# EasyEDA Pro project UrmoukyOpenIPC_250722_v0.2（有小bug不影响使用）.epro, schematic OpenIPC_SSC338Q

## Sheets
1 SSC338Q: Board Name: OpenIPC_SSC338Q; Create Date: 2025-07-22; Page Name: SSC338Q; Project Name: UrmoukyOpenIPC; Schematic Name: OpenIPC_SSC338Q; Update Date: 2025-07-22; Company: 嘉立创EDA; Page Size: A3; Version: V1.0
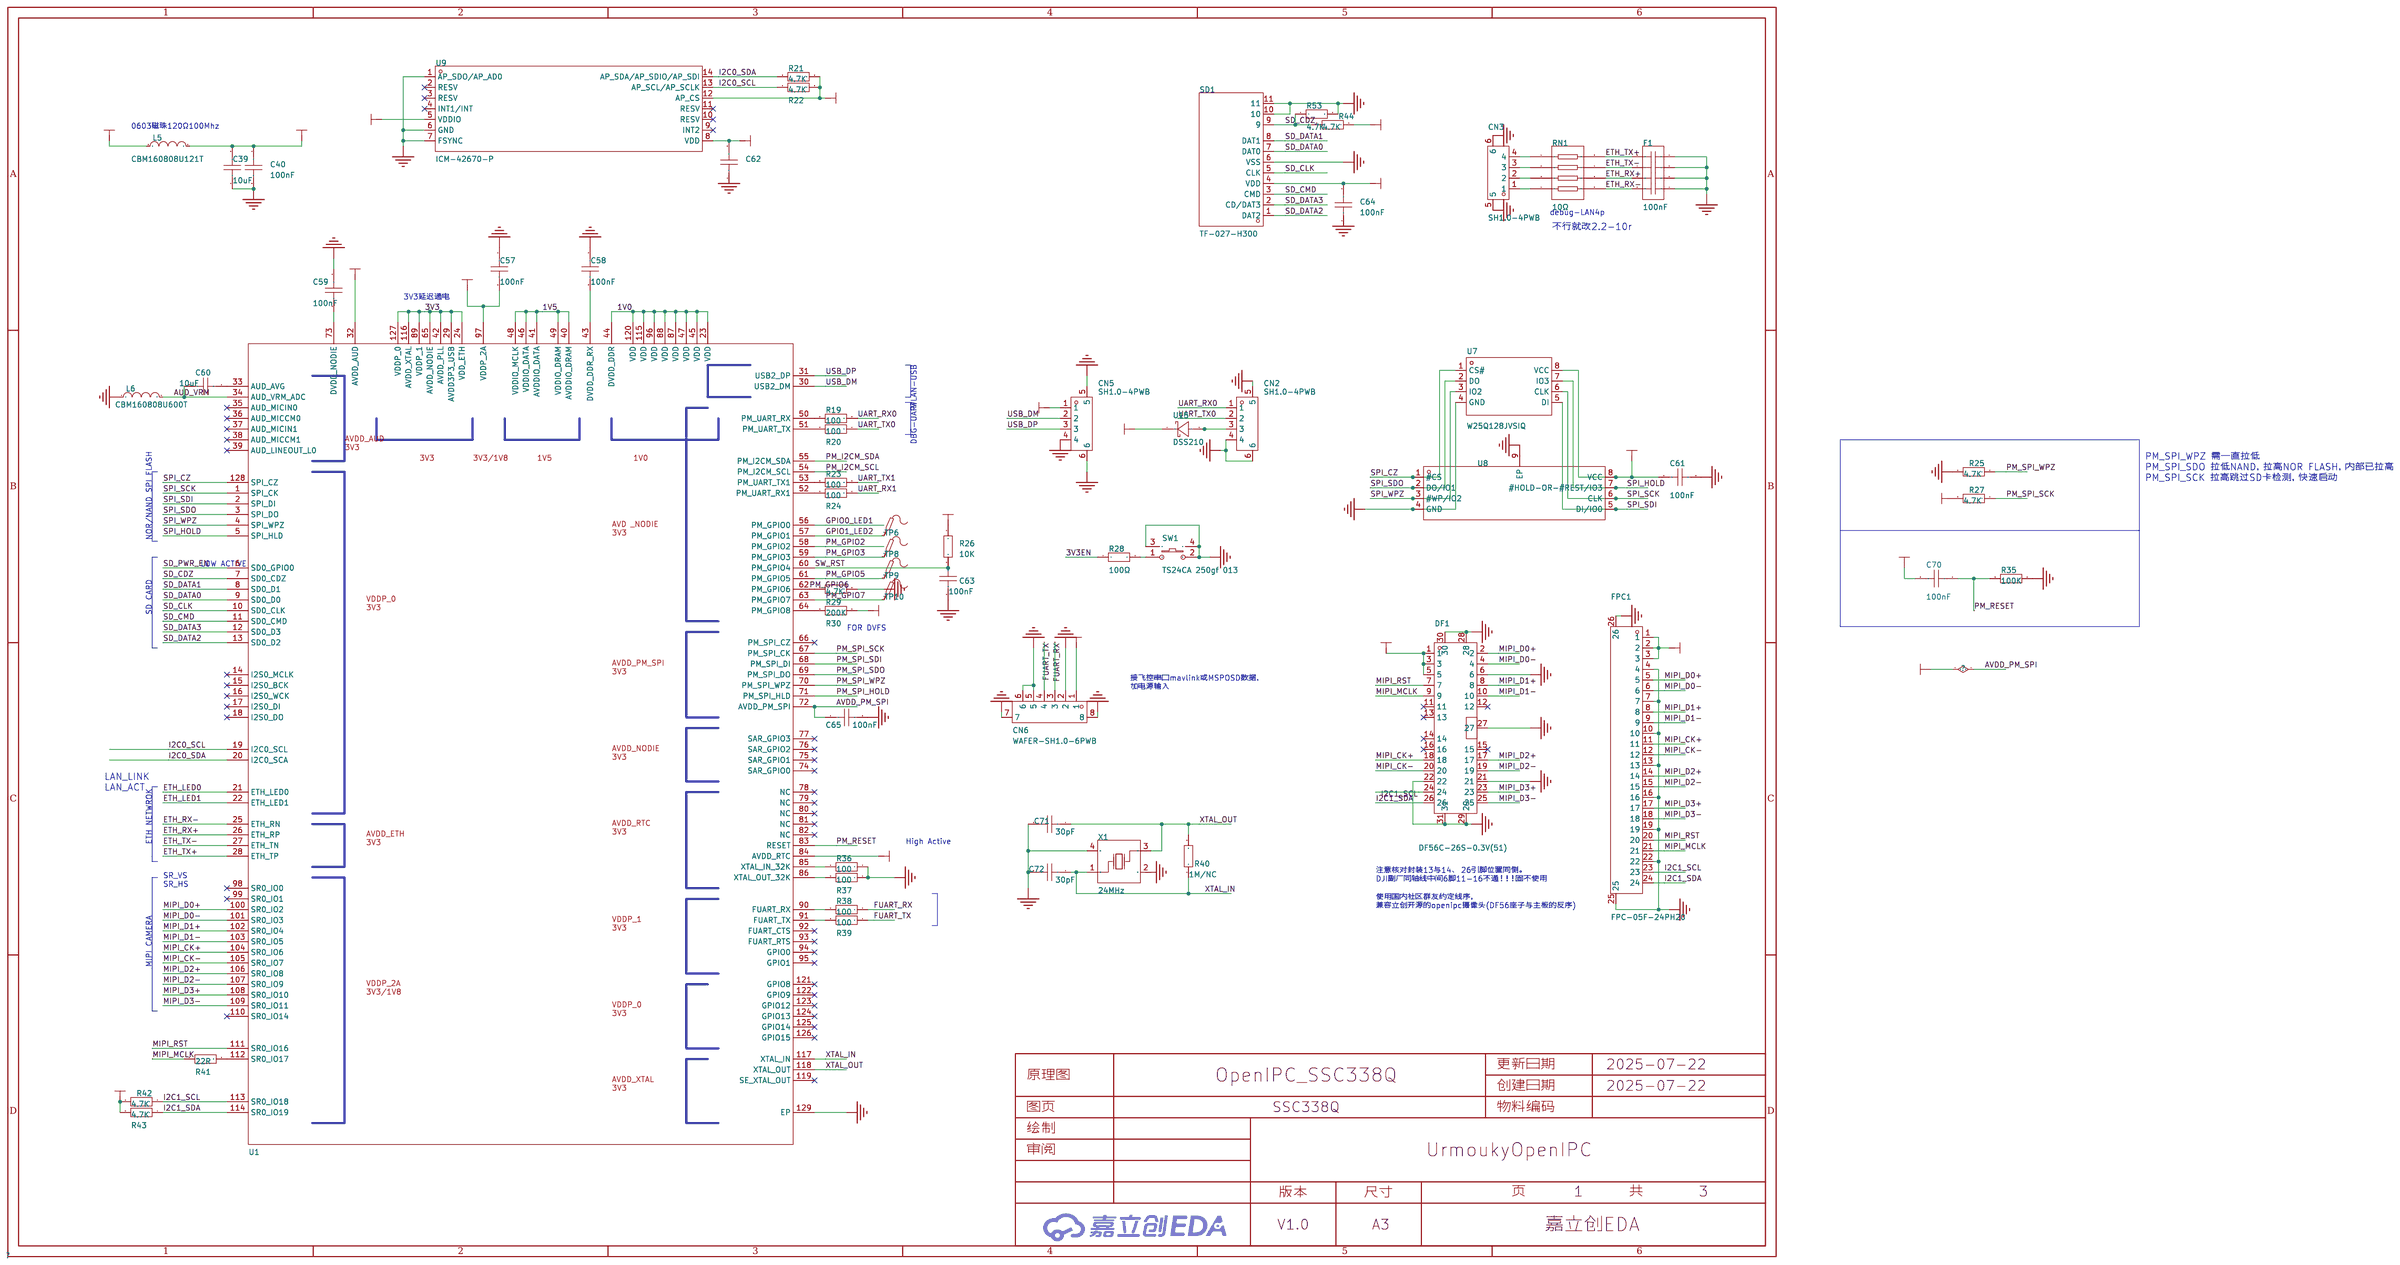
[diagram p0: SSC338Q]
2 Power: Board Name: 338Q改版成品; Create Date: 2025-07-07; Page Name: Power; Project Name: OpenIPC_Urmouky_rebuild; Schematic Name: Schematic1_2; Update Date: 2025-07-08; Page Size: A4
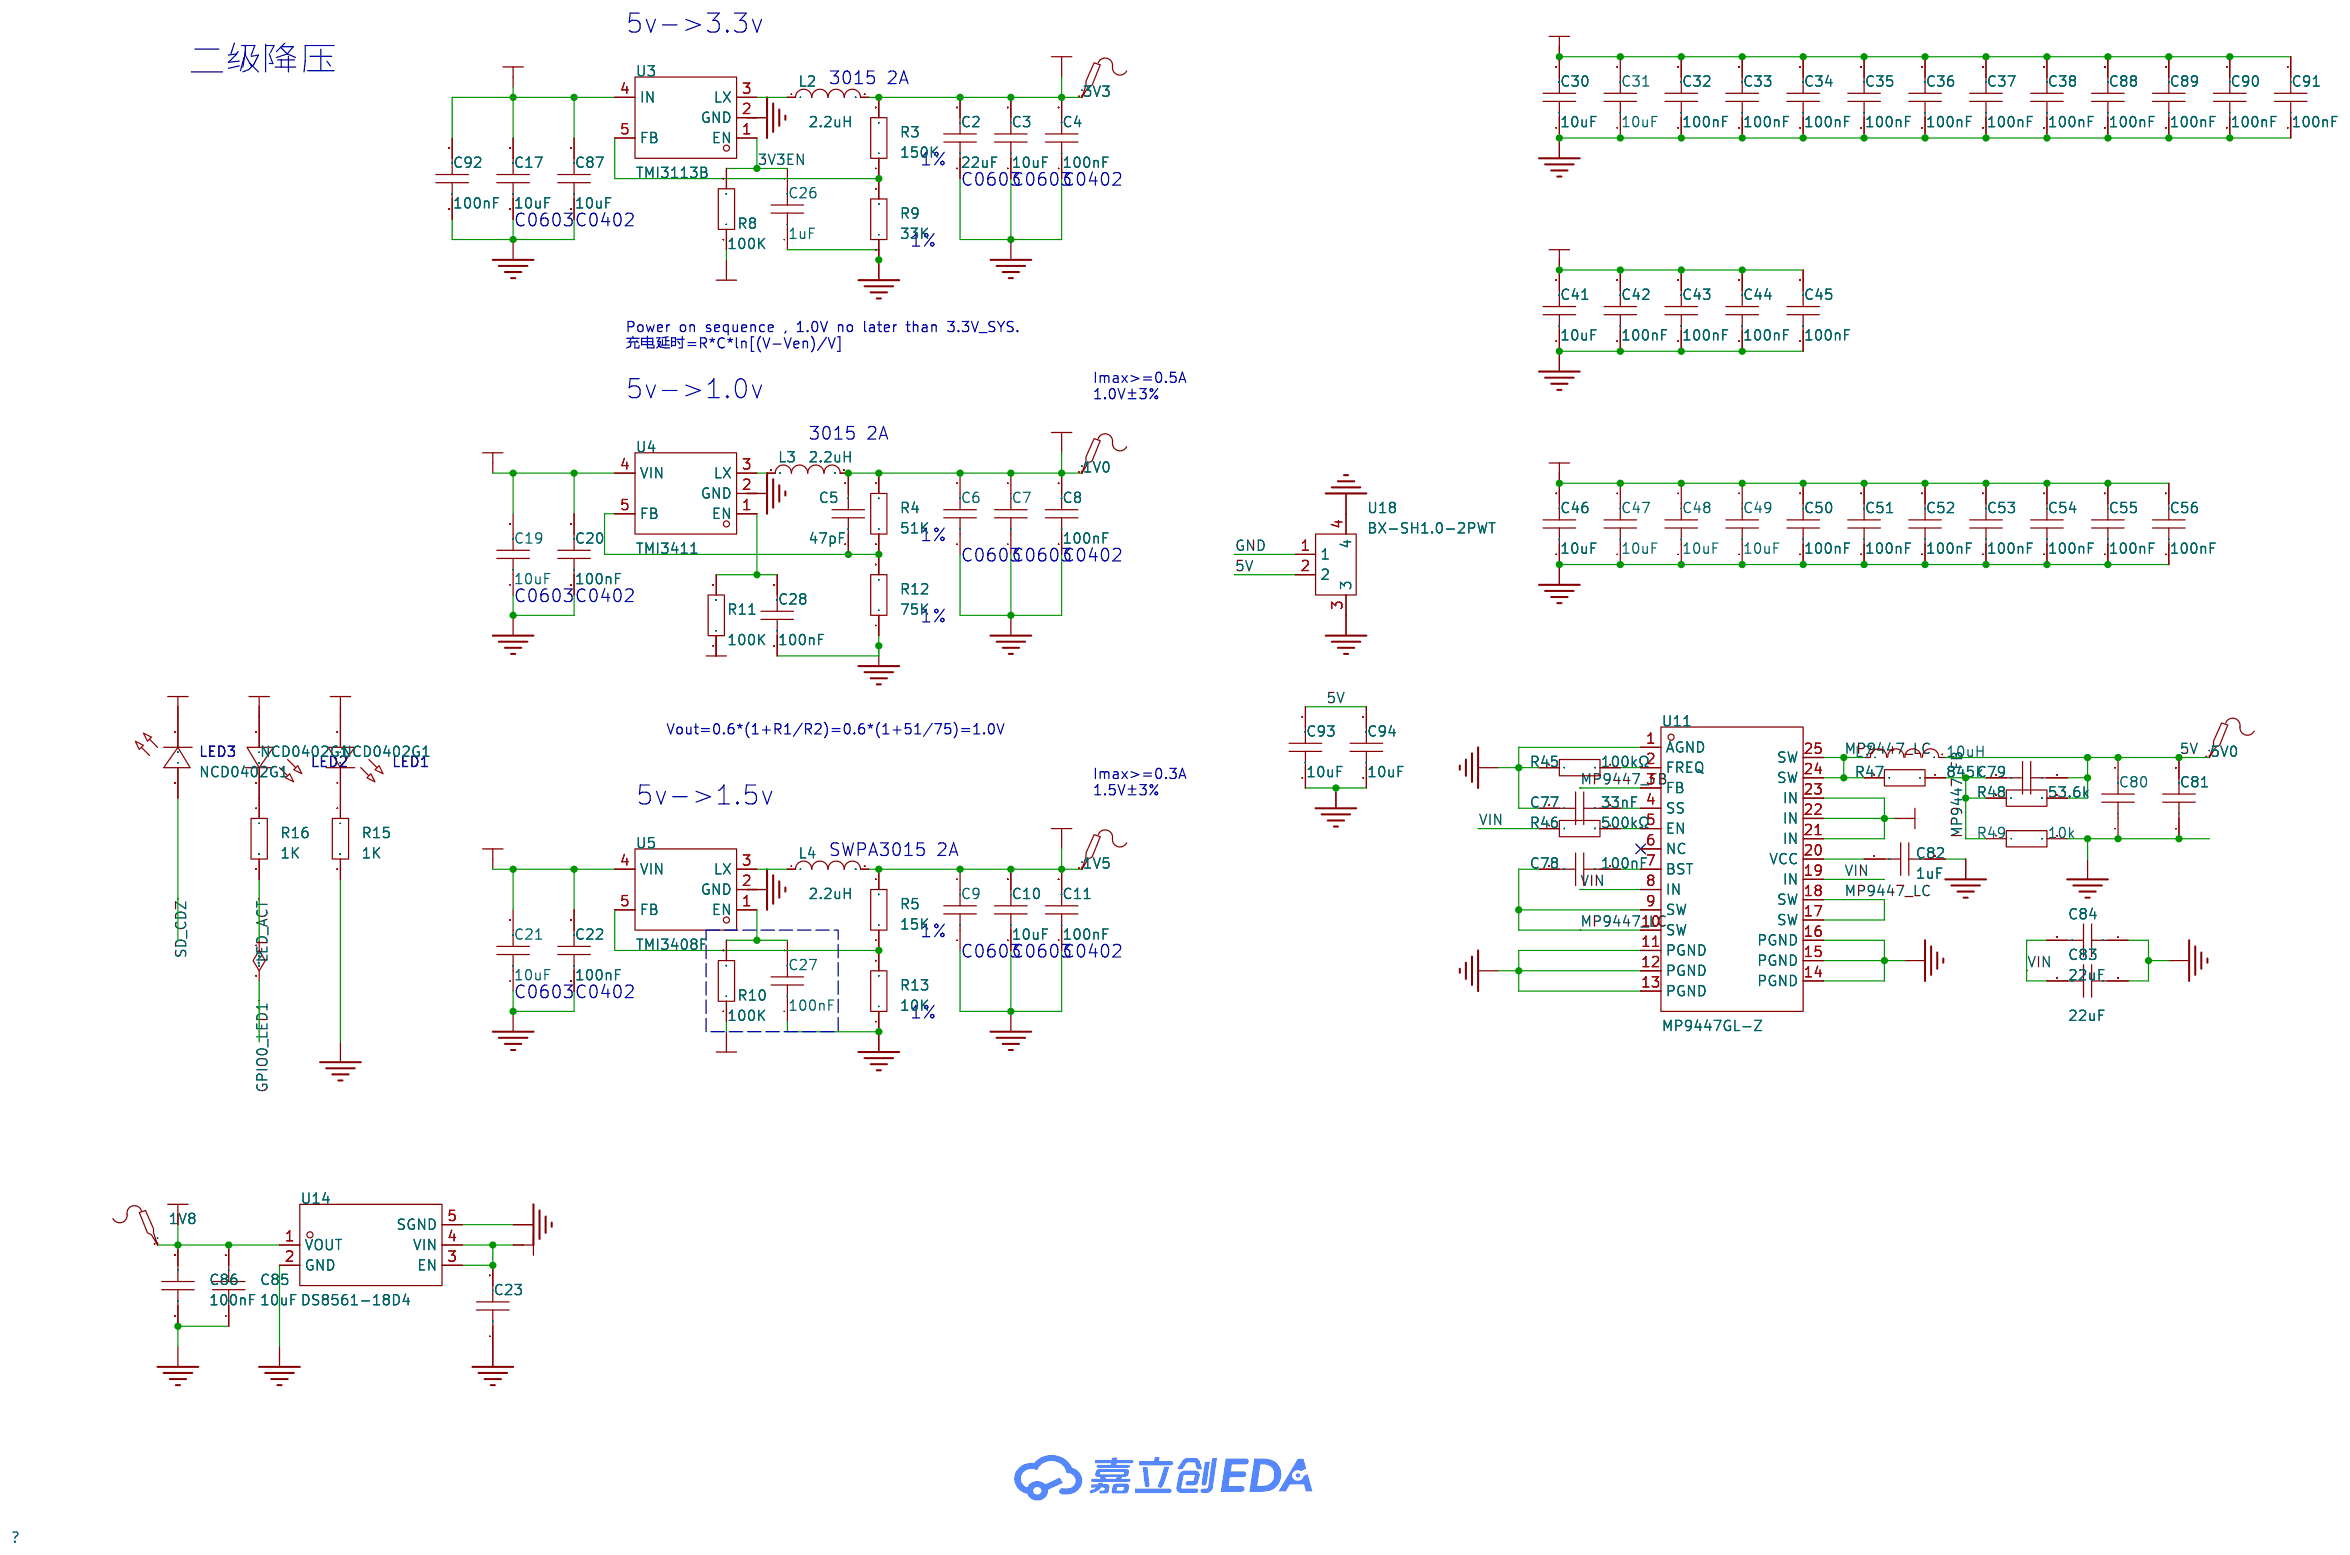
[diagram p1: Power]
3 wangka: Board Name: 338Q改版成品; Create Date: 2025-07-19; Page Name: wangka; Project Name: OpenIPC_Urmouky_rebuild; Schematic Name: Schematic1_2; Update Date: 2025-07-19; Page Size: A4
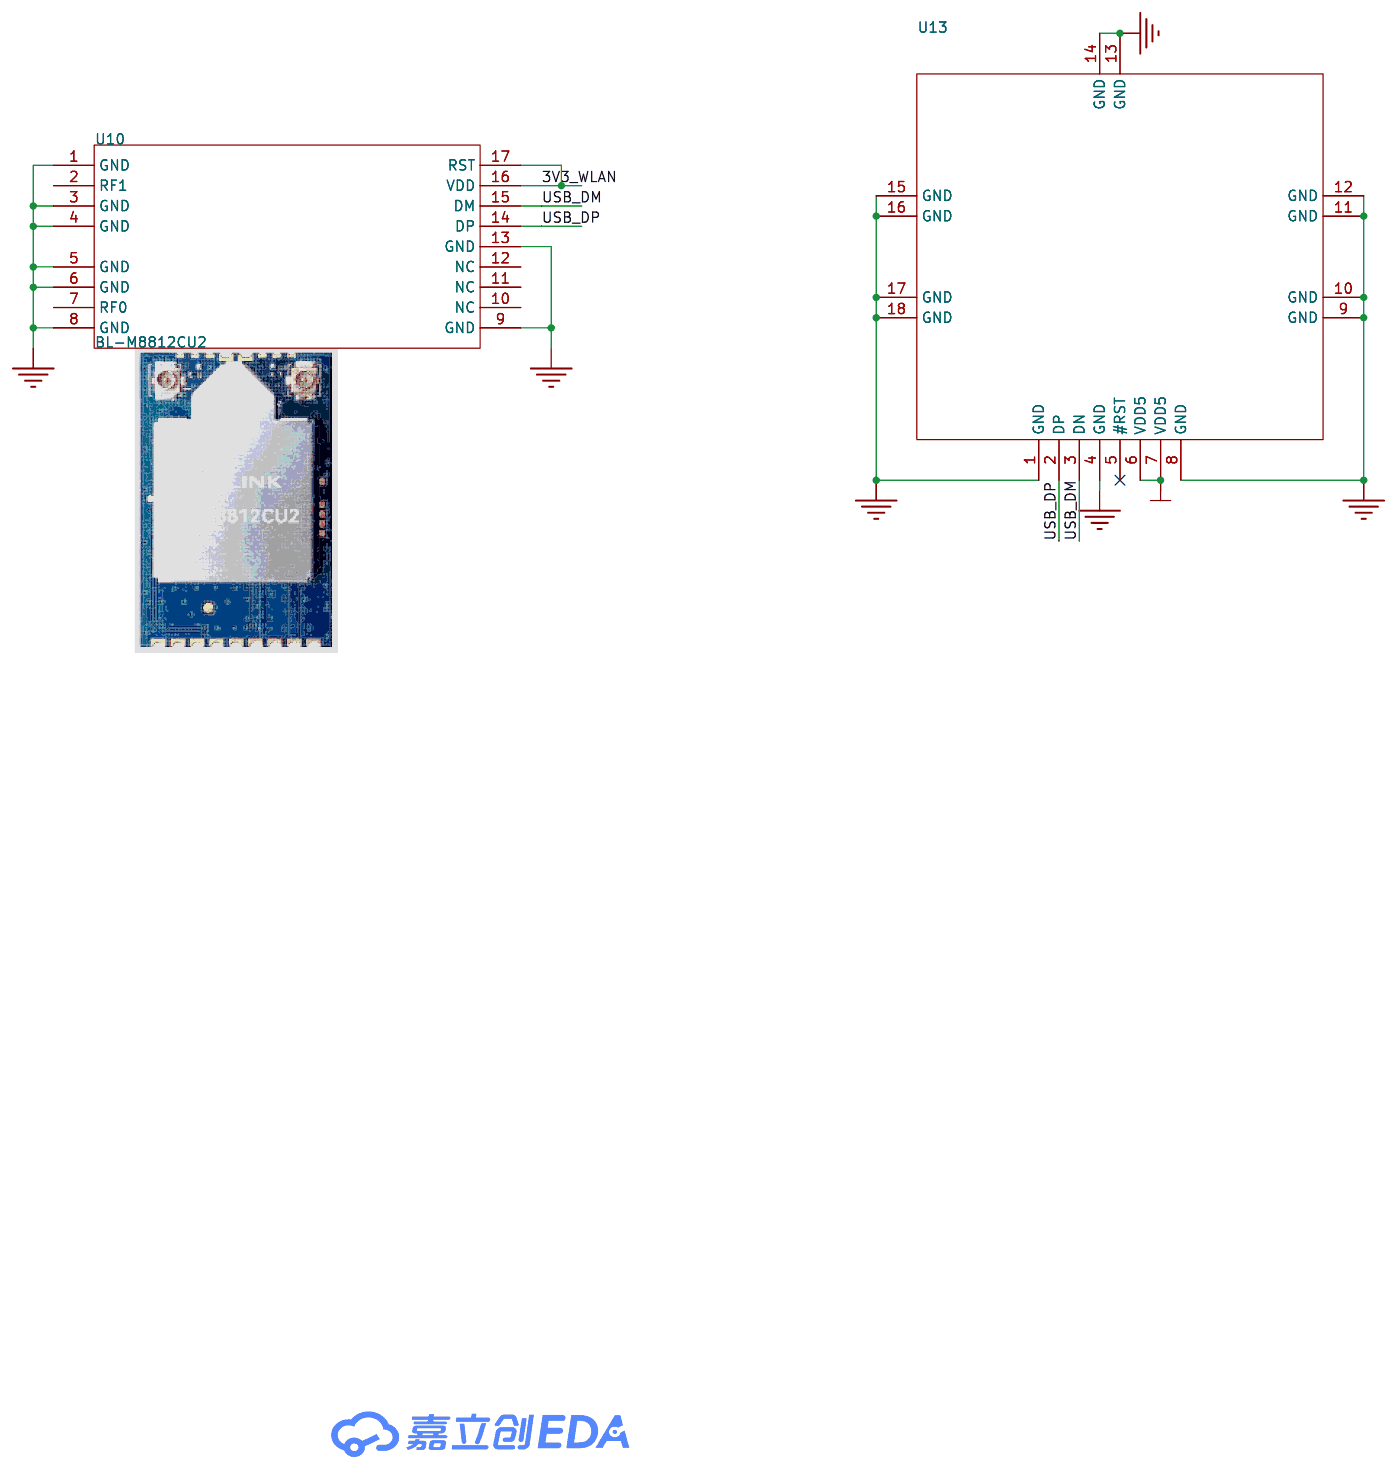
[diagram p2: wangka]

## Parts
sheet Power
1V0  -  [Test-Point-0.5mm]
1V5  -  [Test-Point-0.5mm]
1V8  -  [Test-Point-0.5mm]
3V3  -  [Test-Point-0.5mm]
5V0  -  [Test-Point-0.5mm]
C2  22uF  [R0603]
C3  10uF  [R0603]  (no BOM)
C4  100nF  [R0402]  (no BOM)
C5  47pF  [R0402]
C6  10uF  [R0603]
C7  10uF  [R0603]  (no BOM)
C8  100nF  [R0402]  (no BOM)
C9  10uF  [R0603]
C10  10uF  [R0603]  (no BOM)
C11  100nF  [R0402]
C17  10uF  [R0603]
C19  10uF  [R0603]
C20  100nF  [R0402]
C21  10uF  [R0603]
C22  100nF  [R0402]
C23  10uF  [R0603]
C26  1uF  [R0402]
C27  100nF  [R0402]
C28  100nF  [R0402]
C30  10uF  [R0603]
C31  10uF  [R0603]
C32  100nF  [R0402]
C33  100nF  [R0402]
C34  100nF  [R0402]
C35  100nF  [R0402]
C36  100nF  [R0402]
C37  100nF  [R0402]
C38  100nF  [R0402]
C41  10uF  [R0603]
C42  100nF  [R0402]
C43  100nF  [R0402]
C44  100nF  [R0402]  (no BOM)
C45  100nF  [R0402]  (no BOM)
C46  10uF  [R0603]
C47  10uF  [R0603]
C48  10uF  [R0603]
C49  10uF  [R0603]
C50  100nF  [R0402]
C51  100nF  [R0402]
C52  100nF  [R0402]  (no BOM)
C53  100nF  [R0402]
C54  100nF  [R0402]
C55  100nF  [R0402]  (no BOM)
C56  100nF  [R0402]  (no BOM)
C77  33nF  [R0402]
C78  100nF  [R0402]
C79  390pF  [R0402]
C80  22uF  [C0805]
C81  22uF  [C0805]
C82  1uF  [R0402]
C83  22uF  [C1206]
C84  22uF  [C1206]
C85  10uF  [R0603]
C86  100nF  [R0402]
C87  10uF  [R0603]
C88  100nF  [R0402]
C89  100nF  [R0402]
C90  100nF  [R0402]
C91  100nF  [R0402]
C92  100nF  [R0402]
C93  10uF  [R0603]
C94  10uF  [R0603]
L2  2.2uH  [IND-SMD_L2.5-W2.0_MHCHL2520]
L3  2.2uH  [IND-SMD_L2.5-W2.0_MHCHL2520]
L4  2.2uH  [IND-SMD_L2.5-W2.0_MHCHL2520]
L7  10uH  [IND-SMD_L5.2-W5.2_MCW-0530]
LED1  NCD0402G1  [LED0402-RD]
LED2  NCD0402G1  [LED0402-RD]
LED3  NCD0402G1  [LED0402-RD]
R3  150K  [R0402]
R4  51K  [R0402]
R5  15K  [R0402]
R8  100K  [R0402]
R9  33K  [R0402]
R10  100K  [R0402]
R11  100K  [R0402]
R12  75K  [R0402]
R13  10K  [R0402]
R15  1K  [R0402]
R16  1K  [R0402]
R45  100kΩ  [R0402]
R46  500kΩ  [R0402]
R47  845k  [R0402]
R48  53.6k  [R0402]
R49  10k  [R0402]
U3  TMI3113B  [SOT-23-5_L2.9-W1.6-P0.95-LS2.8-BR]
U4  TMI3411  [SOT-23-5_L2.9-W1.6-P0.95-LS2.8-BL]
U5  TMI3408F  [SOT-23-5_L2.9-W1.6-P0.95-LS2.8-BL]
U11  MP9447GL-Z  [QFN-20_L4.0-W3.0_MP9447GL]
U14  DS8561-18D4  [DFN-4_L1.0-W1.0-P0.65-BL-EP]
U18  BX-SH1.0-2PWT  [CONN-SMD_2P-P1.00_BX-SH1.0-2PWT]
sheet SSC338Q
C39  10uF  [R0603]
C40  100nF  [R0402]
C57  100nF  [R0402]
C58  100nF  [R0402]
C59  100nF  [R0402]
C60  10uF  [R0603]
C61  100nF  [R0402]
C62  10uF  [C0603]  (no BOM)
C63  100nF  [R0402]
C64  100nF  [R0402]
C65  100nF  [R0402]
C70  100nF  [C0402]  (no BOM)
C71  30pF  [R0402]
C72  30pF  [R0402]
CN2  SH1.0-4PWB  [CONN-SMD_4P-P1.00_WAFER-SH1.0-4PWB]
CN3  SH1.0-4PWB  [CONN-SMD_4P-P1.00_WAFER-SH1.0-4PWB]
CN5  SH1.0-4PWB  [CONN-SMD_4P-P1.00_WAFER-SH1.0-4PWB]  (no BOM)
CN6  WAFER-SH1.0-6PWB  [CONN-SMD_6P-P1.00_XUNPU_WAFER-SH1.0-6PWB]
DF1  DF56C-26S-0.3V(51)  [DF56C-26S-0.3V(51)]
F1  100nF  [CAP-ARRAY-SMD_0508-8P-L2.0-W1.3-BL]
FPC1  FPC-05F-24PH20  [FPC-SMD_24P-P0.50_FPC-05F-24PH20]  (no BOM)
L5  CBM160808U121T  [L0603]
L6  CBM160808U600T  [L0603]
R19  100  [R0402]
R20  100  [R0402]
R21  4.7K  [R0402]  (no BOM)
R22  4.7K  [R0402]  (no BOM)
R23  100  [R0402]
R24  100  [R0402]
R25  4.7K  [R0402]
R26  10K  [R0402]
R27  4.7K  [R0402]
R28  100Ω  [R0402]
R29  4.7K  [R0402]
R30  200K  [R0402]
R35  100K  [R0402]
R36  100  [R0402]
R37  100  [R0402]
R38  100  [R0402]
R39  100  [R0402]
R40  1M/NC  [R0402]
R41  22R  [R0402]
R42  4.7K  [R0402]
R43  4.7K  [R0402]
R44  4.7K  [R0402]
R53  4.7K  [R0402]
RN1  10Ω  [RES-ARRAY-SMD_0402-8P-L2.0-W1.0-BL]
SD1  TF-027-H300  [TF-SMD_HYCW104-TF08-375B]
SW1  TS24CA 250gf 013  [SW-SMD_L4.7-W3.5-P3.35-EH]
TP6  -  [Test-Point-0.5mm]  (no BOM)
TP8  -  [Test-Point-0.5mm]
TP9  -  [Test-Point-0.5mm]
TP10  -  [Test-Point-0.5mm]
U1  -  [QFN128_12.3_12.3]
U7  W25Q128JVSIQ  [SOIC-8_L5.3-W5.3-P1.27-LS8.0-BL]
U8  W25Q128JVPIQ  [WSON-8_L6.0-W5.0-P1.27-BL-EP]  (no BOM)
U9  ICM-42670-P  [LGA-14_L3.0-W2.5-P0.50-TL_QMI8658A]  (no BOM)
U15  DSS210  [SOD-123_L2.7-W1.8-LS3.7-RD]
X1  24MHz  [CRYSTAL-SMD_4P-L2.0-W1.6-BL-A]
sheet wangka
U10  BL-M8812CU2  [BL-M8812CU2]  (no BOM)
U13  BL-M8812EU2  [BL-M8812EU2]

## Library data of the parts
1V0 1V5 1V8 3V3 5V0 TP6 TP8-TP10 = Test-Point: Test Point 测试点
C2 C3 C6 C7 C9 C10 C17 C19 C21 C23 C30 C31 C39 C41 C46-C49 C60 C62 C85 C87 C93 C94 = CL10A106MA8NRNC: 容值:10uF;精度:±20%;额定电压:25V;材质(温度系数):X5R;; LCSC Part Name: 10uF ±20% 25V; Supplier Part: C96446; Manufacturer: SAMSUNG(三星); Supplier Footprint: 0603; JLCPCB Part Class: Basic Part; Datasheet: https://atta.szlcsc.com/upload/public/pdf/source/20160218/1457707763339.pdf; Supplier: LCSC; Tolerance: ±20%; Voltage Rated: 25V; Temperature Coefficient: X5R
C4 C8 C11 C20 C22 C26-C28 C32-C38 C40 C42-C45 C50-C59 C61 C63-C65 C70 C78 C86 C88-C92 = CL05B104KB54PNC: 容值:100nF;精度:±10%;额定电压:50V;材质(温度系数):X7R;; LCSC Part Name: 100nF ±10% 50V; Supplier Part: C307331; Manufacturer: SAMSUNG(三星); Supplier Footprint: 0402; JLCPCB Part Class: Basic Part; Datasheet: https://atta.szlcsc.com/upload/public/pdf/source/20160218/1457707763339.pdf; Supplier: LCSC; Tolerance: ±10%; Voltage Rated: 50V; Temperature Coefficient: X7R
C5 C82 = CAP_0402: Supplier Footprint: 0402
C77 = GRM155R71H333KE14D: 容值:33nF;精度:±10%;额定电压:50V;材质(温度系数):X7R;; LCSC Part Name: 33nF ±10% 50V; Supplier Part: C415530; Manufacturer: muRata(村田); Supplier Footprint: 0402; JLCPCB Part Class: 扩展库; Datasheet: https://atta.szlcsc.com/upload/public/pdf/source/20200305/C490387_23319AE8C154DEB24C505E6C82A8106A.pdf; Supplier: LCSC; Tolerance: ±10%; Voltage Rated: 50V; Temperature Coefficient: X7R
C79 = GCM1555C1H391JA16D: 容值:390pF;精度:±5%;额定电压:50V;材质(温度系数):C0G;; LCSC Part Name: 390pF ±5% 50V; Supplier Part: C723890; Manufacturer: muRata(村田); Supplier Footprint: 0402; JLCPCB Part Class: Extended Part; Datasheet: https://atta.szlcsc.com/upload/public/pdf/source/20200817/C723890_6D0123DDD2DCBBBFE573AA01BD8E192A.pdf; Supplier: LCSC; Tolerance: ±5%; Voltage Rated: 50V; Temperature Coefficient: C0G
C80 C81 = CL21A226MAQNNNE: 容值:22uF;精度:±20%;额定电压:25V;材质(温度系数):X5R;; LCSC Part Name: 22uF ±20% 25V; Supplier Part: C45783; Manufacturer: SAMSUNG(三星); Supplier Footprint: 0805; JLCPCB Part Class: Basic Part; Datasheet: https://atta.szlcsc.com/upload/public/pdf/source/20160218/1457707763339.pdf; Supplier: LCSC; Tolerance: ±20%; Voltage Rated: 25V; Temperature Coefficient: X5R
C83 C84 = CGA1206X5R226M350NT: 容值:22uF;精度:±20%;额定电压:35V;温度系数:X5R;; LCSC Part Name: 22uF ±20% 35V; Supplier Part: C6119969; Manufacturer: HRE(芯声); Supplier Footprint: 1206; JLCPCB Part Class: 扩展库; Supplier: LCSC; Tolerance: ±20%; Voltage Rating: 35V; Temperature Coefficient: X5R
L2-L4 = FTC252012S2R2MBCA: 电感值:2.2uH;精度:±20%;额定电流:3A;饱和电流(Isat):3.8A;类型:一体成型电感;; LCSC Part Name: 2.2uH ±20% 3.8A; Supplier Part: C5832372; Manufacturer: cjiang(长江微电); Supplier Footprint: 1008; JLCPCB Part Class: Extended Part; Datasheet: https://atta.szlcsc.com/upload/public/pdf/source/20230602/8FFEDA9C0247A92A0D4B67554BFE4091.pdf; Supplier: LCSC; Tolerance: ±20%; Rated Current: 3A; Saturation Current (Isat): 3.8A; DC Resistance (DCR): 55mΩ; Type: 一体成型电感
L7 = SMMS0530-100M: 电感值:10uH;精度:±20%;额定电流:3.2A;饱和电流(Isat):3.5A;类型:一体成型电感;; LCSC Part Name: 10uH ±20% 3.5A; Supplier Part: C181721; Manufacturer: SXN(顺翔诺); Supplier Footprint: SMD; JLCPCB Part Class: Extended Part; Datasheet: https://atta.szlcsc.com/upload/public/pdf/source/20210810/BBF24330FB2F5029F637830BA9C42C0D.pdf; Supplier: LCSC; Tolerance: ±20%; Rated Current: 3.2A; Saturation Current (Isat): 3.5A; DC Resistance (DCR): 125mΩ; Type: 一体成型电感
LED1-LED3 = NCD0402G1: 发光颜色:翠绿色;正向电压(VF):2.6V~3.6V;功率:72mW;正向电流:5mA;主波长:515nm~530nm;透镜颜色:无色透明透镜;发光强度:100mcd~270mcd;发光角度:130°;工作温度:-30℃~+85℃;; Supplier Part: C130723; Manufacturer: 国星光电; Supplier Footprint: 0402; JLCPCB Part Class: Extended Part; Datasheet: https://atta.szlcsc.com/upload/public/pdf/source/20200820/C130723_D39B4171A1B8D8D2F39C1DC521C0922A.pdf; Supplier: LCSC; Emitted Color: 翠绿色; Forward Voltage (VF): 2.6V~3.6V; Power Dissipation: 72mW; Forward Current: 5mA; Dominant Wavelength: 515nm~530nm; Lens Color: 无色透明透镜; Luminous Intensity: 100mcd~270mcd; Viewing Angle: 130°; Operating Temperature: -30℃~+85℃
R3-R5 R8-R13 R15 R16 R19-R30 R35-R44 R53 = Res_0402: Supplier Footprint: 0402
R45-R49 = 0402WGF1003TCE: 电阻类型:厚膜电阻;阻值:100kΩ;精度:±1%;功率:62.5mW;最大工作电压:50V;温度系数:±100ppm/℃;; LCSC Part Name: 100kΩ ±1% 62.5mW 厚膜电阻; Supplier Part: C25741; Manufacturer: UNI-ROYAL(厚声); Supplier Footprint: 0402; JLCPCB Part Class: Basic Part; Datasheet: https://atta.szlcsc.com/upload/public/pdf/source/20200306/C422600_1E6D84923E4A46A82E41ADD87F860B5C.pdf; Supplier: LCSC; Tolerance: ±1%; Power(Watts): 62.5mW; Overload Voltage (Max): 50V; Temperature Coefficient: ±100ppm/℃; Type: 厚膜电阻; Operating Temperature Range: -55℃~+155℃
U3 = TMI3113B: Supplier Part: C2889165; Supplier Footprint: SOT-23-5; JLCPCB Part Class: 扩展库; Datasheet: https://atta.szlcsc.com/upload/public/pdf/source/20210826/07E040F45A28B7976AD450158994FFB7.pdf; Supplier: LCSC
U4 = TMI3411: 电源管理IC,DCDC,Buck,1MHz,2.3~6V,2A,SOT23-5,VFB=0.6V,TMI3411(TMI); Supplier Part: C478952; Manufacturer: TMI(拓尔微); Supplier Footprint: SOT-23-5; JLCPCB Part Class: 扩展库; Datasheet: https://atta.szlcsc.com/upload/public/pdf/source/20200106/C478952_0771C44371C5553A1E48566244E442F9.pdf; Supplier: LCSC
U5 = TMI3408F: Supplier Part: C5138141; Supplier Footprint: SOT-23-5; JLCPCB Part Class: 扩展库; Supplier: LCSC
U11 = MP9447GL-Z: 功能类型:降压型;输出类型:可调;输入电压:4.5V~36V;输出电压:800mV~32.4V;输出电流(最大值):5A;; Supplier Part: C65839; Manufacturer: MPS(芯源); Supplier Footprint: QFN-25(3x4); JLCPCB Part Class: 扩展库; Datasheet: https://atta.szlcsc.com/upload/public/pdf/source/20240130/03C10127DA3AD0E4831179ACBC71E87F.pdf; Supplier: LCSC; Function: 降压型; Output Type: 可调; Input Voltage: 4.5V~36V; Output Voltage: 800mV~32.4V; Output Current (Max): 5A; Switching Frequency: 650kHz; Operating Temperature: -40℃~+125℃@(TJ); Synchronous Rectification: 是; Number of Outputs: 1; Topology: 降压式; Switch tube (built-in/external): 内置
U14 = DS8561-18D4: 输出类型:固定;最大输入电压:-;输出电压:1.8V;输出电流:300mA;电源纹波抑制比(PSRR):75dB@(1kHz);输出极性:正极;; Supplier Part: C5795639; Manufacturer: DSTECH(奥简科技); Supplier Footprint: DFN1x1-4L; JLCPCB Part Class: 扩展库; Datasheet: https://atta.szlcsc.com/upload/public/pdf/source/20230512/CE82A72B0C034B98A06CB07609DC7EBE.pdf; Supplier: LCSC; Output Type: 固定; Output Voltage: 1.8V; Output Current: 300mA; Power Supply Rejection Ratio (PSRR): 75dB@(1kHz); Dropout Voltage: 60mV@100mA; standby current: 2uA; Noise: 80uVrms; Operating Temperature: -40℃~+85℃; Output Polarity: 正极; Number of Outputs: 1
U18 = BX-SH1.0-2PWT: 插针结构:1x2P;间距:1mm;安装方式:卧贴;参考系列:SH;总PIN数:2P;排数:1;每排PIN数:2;行距:-;额定电流:1A;触头材质:黄铜;触头镀层:锡;工作温度:-;; LCSC Part Name: 1x2P 间距:1mm 卧贴 系列:SH; Supplier Part: C18077908; Manufacturer: Bossie(博锡); Supplier Footprint: SMD,P=1mm,卧贴; JLCPCB Part Class: 扩展库; Datasheet: https://atta.szlcsc.com/upload/public/pdf/source/20231017/8FBE5F9BDB41D422B41332696EF41894.pdf; Supplier: LCSC; Pins Structure: 1x2P; Pitch: 1mm; Mounting Type: 卧贴; Reference Series: SH; Number of Pins: 2P; Number of Rows: 1; Number of PINs Per Row: 2; Current Rating: 1A; Contact Material: 黄铜; Contact Plating: 锡; Supplementary Features: 辅助焊脚; Color: 米色; Z-Height of the Board: 3.15mm; X-Length of Bottom Edge on Board (Spacing Line): 4.35mm; Y-Width of Bottom Edge on Board: 5.05mm
C71 C72 = 0402CG200J500NT: 容值:20pF;精度:±5%;额定电压:50V;材质(温度系数):C0G;; LCSC Part Name: 20pF ±5% 50V; Supplier Part: C1554; Manufacturer: FH(风华); Supplier Footprint: 0402; JLCPCB Part Class: Basic Part; Datasheet: https://atta.szlcsc.com/upload/public/pdf/source/20200305/C486355_26A10D38EF8C2A5C37091D0039909270.pdf; Supplier: LCSC; Tolerance: ±5%; Voltage Rated: 50V; Temperature Coefficient: C0G
CN2 CN3 CN5 = WAFER-SH1.0-4PWB: 插针结构:1x4P;间距:1mm;安装方式:卧贴;总PIN数:4P;排数:1;每排PIN数:4;额定电流:1A;工作温度范围:-25℃~+85℃;; LCSC Part Name: 1x4P 间距:1mm 卧贴; Supplier Part: C3029343; Manufacturer: XUNPU(讯普); Supplier Footprint: SMD,P=1mm,卧贴; Datasheet: https://atta.szlcsc.com/upload/public/pdf/source/20220527/1879B8210BD3B2006BCEAC1A40D397B6.pdf; Supplier: LCSC; Pins Structure: 1x4P; Pitch: 1mm; Mounting Style: 卧贴; Number of Pins: 4P; Number of Rows: 1; Number of PINs Per Row: 4; Current Rating (Max): 1A; Operating Temperature Range: -25℃~+85℃
CN6 = WAFER-SH1.0-6PWB: 插针结构:1x6P;间距:1mm;安装方式:卧贴;参考系列:SH;总PIN数:6P;排数:1;每排PIN数:6;行距:-;额定电流:1A;触头材质:黄铜;触头镀层:-;工作温度:-25℃~+85℃;; LCSC Part Name: 1x6P 间距:1mm 卧贴 系列:SH; Supplier Part: C3029345; Manufacturer: XUNPU(讯普); Supplier Footprint: SMD,P=1mm,卧贴; JLCPCB Part Class: 扩展库; Datasheet: https://atta.szlcsc.com/upload/public/pdf/source/20220527/1879B8210BD3B2006BCEAC1A40D397B6.pdf; Supplier: LCSC; Pins Structure: 1x6P; Pitch: 1mm; Mounting Type: 卧贴; Reference Series: SH; Number of Pins: 6P; Number of Rows: 1; Number of PINs Per Row: 6; Current Rating: 1A; Contact Material: 黄铜; Operating Temperature: -25℃~+85℃; Voltage Rating: 50V; Plastic Material: LCP; Supplementary Features: 辅助焊脚; Color: 米色; Z-Height of the Board: 3.15mm; X-Length of Bottom Edge on Board (Spacing Line): 8.35mm; Y-Width of Bottom Edge on Board: 5.05mm
DF1 = DF56C-26S-0.3V(51)_C5338332: Supplier Part: C5338332; Manufacturer: HRS(广濑); Supplier Footprint: SMD,P=0.3mm; JLCPCB Part Class: 扩展库; Datasheet: https://atta.szlcsc.com/upload/public/pdf/source/20221219/44C927CDEC8475048CBD03EDCFCE7300.pdf; Supplier: LCSC
F1 = CA0508KRX7R7BB104: 容值:100nF;精度:±10%;额定电压:16V;温度系数:X7R;电路形式:隔离;; Supplier Part: C1870407; Manufacturer: YAGEO(国巨); Supplier Footprint: 0508; JLCPCB Part Class: 扩展库; Datasheet: https://atta.szlcsc.com/upload/public/pdf/source/20220525/176E31E9D3C0708DD2DF020B4CF8BD4B.pdf; Supplier: LCSC; Tolerance: ±10%; Rated Voltage: 16V; Temperature Coefficient: X7R; Number of Capacitors: 4; Circuit Type: 隔离
FPC1 = FPC-05F-24PH20: 锁定特性:翻盖式;触点类型:下接;触点数量:24P;间距:0.5mm;安装类型:卧贴;工作温度范围:-25℃~+85℃;; LCSC Part Name: 间距:0.5mm P数:24P 翻盖式 下接; Supplier Part: C2856805; Manufacturer: XUNPU(讯普); Supplier Footprint: SMD,P=0.5mm,卧贴; JLCPCB Part Class: Extended Part; Datasheet: https://atta.szlcsc.com/upload/public/pdf/source/20210922/C2856805_8542C20E2D7FF0FC4EEBD919AE0F6905.pdf; Supplier: LCSC; Locking Feature: 翻盖式; Contact Type: 下接; Number of Contacts: 24P; Pitch: 0.5mm; Mounting Type: 卧贴; FFC, FCB Thickness: 0.3mm; Height Above Board: 2mm; Operating Temperature Range: -25℃~+85℃
L5 = CBM160808U121T: 标称阻抗@测试频率:120Ω@100MHz;误差:±25%;直流电阻(RDC):65mΩ;; LCSC Part Name: 单路 0603磁珠 阻抗120Ω@100MHz; Supplier Part: C62708; Manufacturer: FH(风华); Supplier Footprint: 0603; JLCPCB Part Class: 扩展库; Datasheet: https://atta.szlcsc.com/upload/public/pdf/source/20190124/C361675_B974276783ADBAD97CE4BE3714FD6C79.pdf; Supplier: LCSC; Impedance @ Frequency: 120Ω@100MHz; Tolerance: ±25%; DC Resistance: 65mΩ; Current Rating: 2A; Circuits: 1
L6 = CBM160808U600T: 标称阻抗@测试频率:60Ω@100MHz;误差:±25%;直流电阻(RDC):40mΩ;; LCSC Part Name: 单路 0603磁珠 阻抗60Ω@100MHz; Supplier Part: C394426; Manufacturer: FH(风华); Supplier Footprint: 0603; JLCPCB Part Class: 扩展库; Datasheet: https://atta.szlcsc.com/upload/public/pdf/source/20191023/C394418_D151FE68650C03FC0CC5FC874F862124.pdf; Supplier: LCSC; Impedance @ Frequency: 60Ω@100MHz; Tolerance: ±25%; DC Resistance: 40mΩ; Current Rating: 3A; Circuits: 1
RN1 = 4D02WGJ0220TCE: 电阻器数:4;阻值:22Ω;精度:±5%;单个元件功率:62.5mW;温度系数:±200ppm/℃;; LCSC Part Name: 22Ω ±5%; Supplier Part: C25499; Manufacturer: UNI-ROYAL(厚声); Supplier Footprint: 0402x4; JLCPCB Part Class: Extended Part; Datasheet: https://atta.szlcsc.com/upload/public/pdf/source/20191224/C474318_2527498AE30E813171187CCD28401A71.pdf; Supplier: LCSC; Number of Resistors: 4; Tolerance: ±5%; Power(Watts): 62.5mW; Temperature Coefficient: ±200ppm/℃; Number of Pins: 8
SD1 = TF-027-H300: 卡连接方式:拔插式;卡类型:MicroSD卡(TF卡);连接器类型:卡座;本体最大高度:3mm;触头材质:-;触头镀层:金;工作温度范围:-20℃~+85℃;焊接温度(最大值):-;; LCSC Part Name: 拔插式 MicroSD卡(TF卡) 卡座; Supplier Part: C5310495; Manufacturer: HANBO(汉博); Supplier Footprint: SMD; JLCPCB Part Class: 扩展库; Datasheet: https://atta.szlcsc.com/upload/public/pdf/source/20221209/91D0698AD722546CAE445F87A6450B20.pdf; Supplier: LCSC; Card Connection Mode: 拔插式; Card Type: MicroSD卡(TF卡); Connector Type: 卡座; Maximum Body Height: 3mm; Contact Plating: 金; Operating Temperature Range: -20℃~+85℃
SW1 = TS24CA 250gf 013: 电路结构:单刀单掷;按钮形状:矩形按钮;作用力:250gf;安装方式:卧贴;开关长度:4.55mm;开关宽度:1.8mm;开关高度:3.5mm;带支架:不带;触点电流:50mA;额定电压(AC):-;额定电压(DC):12V;额定功率:0.6W;绝缘电阻:100MΩ;带灯:无;机械寿命:3万次;; LCSC Part Name: 2*4*3.5mm半包小贝贝TS-018小侧按键m165蓝牙耳机开关 250gf; Supplier Part: C5373430; Manufacturer: SHOU HAN(首韩); Supplier Footprint: SMD; JLCPCB Part Class: Extended Part; Datasheet: https://atta.szlcsc.com/upload/public/pdf/source/20230321/913029B0FB0CD391AF5EFD51697D8EC4.pdf; Supplier: LCSC; Circuit: 单刀单掷; Actuator Style: 矩形按钮; Operating Force: 250gf; Mounting Style: 卧贴; Switch Length: 4.55mm; Switch Width: 1.8mm; Switch Height: 3.5mm; Strike Gundam: 不带; Contact Current: 50mA; Voltage Rating (DC): 12V; Power Rating: 0.6W; Insulation Resistance: 100MΩ; Actuator/Cap Color: 黑色; With Lamp: 无; Mechanical Life: 3万次; Operating Temperature: -40℃~+85℃
U1 = SSC338Q: SigmaStar SOCDual A7
U7 = W25Q128JVSIQ: 接口类型:-;存储容量:128Mbit;时钟频率(fc):-;; LCSC Part Name: W25Q128JVSIQ 编带; Supplier Part: C97521; Manufacturer: WINBOND(华邦); Supplier Footprint: SOIC-8-208mil; JLCPCB Part Class: 基础库; Datasheet: https://atta.szlcsc.com/upload/public/pdf/source/20170316/1489627409956.pdf; Supplier: LCSC; Memory Size: 128Mbit
U8 = W25Q128JVPIQ_C190862: 存储容量:128Mbit;; Supplier Part: C190862; Manufacturer: WINBOND(华邦); Supplier Footprint: WSON-8-EP(5x6); JLCPCB Part Class: Extended Part; Datasheet: https://atta.szlcsc.com/upload/public/pdf/source/20190705/C401662_06B6D416F67ED315879B366F63A3F7C9.pdf; Supplier: LCSC; Memory Size: 128Mbit
U9 = ICM-42670-P: 传感器类型:加速度计陀螺仪;; Supplier Part: C3288646; Manufacturer: TDK InvenSense(应美盛); Supplier Footprint: LGA-14(2.5x3); JLCPCB Part Class: 扩展库; Supplier: LCSC; Sensor Type: 加速度计陀螺仪; Operating Temperature: -40℃~+85℃
U15 = DSS210_C5380711: 二极管配置:独立式;正向压降(Vf):850mV@2A;直流反向耐压(Vr):100V;平均整流电流(Io):2A;; Supplier Part: C5380711; Manufacturer: FUXINSEMI(富芯森美); Supplier Footprint: SOD-123; JLCPCB Part Class: 扩展库; Datasheet: https://atta.szlcsc.com/upload/public/pdf/source/20230323/9B877F40855942CE38B87C88B0AFDBD6.pdf; Supplier: LCSC; Diode Configuration: 独立式; Forward Voltage (Vf@If): 850mV@2A; Reverse Voltage (Vr): 100V; Average Rectified Current (Io): 2A; Reverse Leakage Current (Ir): 100uA@100V; Peak forward surge current: 45A
X1 = XL7EL89CKI-111YLC-24M: 晶振类型:贴片晶振;频率:24MHz;常温频差:±10ppm;负载电容:8pF;频率稳定度:±20ppm;; LCSC Part Name: YSX211SL 24MHZ 4P 2016 8PF ±10PPM -40~85℃ (±20PPM); Supplier Part: C2965580; Manufacturer: YXC(扬兴晶振); Supplier Footprint: SMD2016-4P; JLCPCB Part Class: Extended Part; Datasheet: https://atta.szlcsc.com/upload/public/pdf/source/20240329/C26C9A15A73CBCFBF373B30A8E126750.pdf; Supplier: LCSC; Type: 贴片晶振; Normal temperature Frequency Tolerance: ±10ppm; Load Capacitance: 8pF; Frequency Stability: ±20ppm; Operating Temperature: -40℃~+85℃
U10 = BL-M8812CU2
U13 = BL-M8812EU2: Supplier: 某宝; link: https://www.b-link.net.cn/product_36_321.html; _: 3

## Nets
1V0: 1V0.1 C5.2 C6.2 C7.2 C8.2 C46.2 C47.2 C48.2 C49.2 C50.2 C51.2 C52.2 C53.2 C54.2 C55.2 C56.2 L3.2 R4.2 U1.23(VDD) U1.44(DVDD_DDR) U1.45(VDD) U1.47(VDD) U1.87(VDD) U1.88(VDD) U1.96(VDD) U1.115(VDD) U1.120(VDD)
1V5: 1V5.1 C9.2 C10.2 C11.2 C41.2 C42.2 C43.2 C44.2 C45.2 L4.2 R5.2 U1.40(AVDDIO_DRAM) U1.41(AVDDIO_DATA) U1.46(VDDIO_DATA) U1.48(VDDIO_MCLK) U1.49(VDDIO_DRAM)
1V8: 1V8.1 C57.2 C85.2 C86.2 R42.2 R43.2 U1.97(VDDP_2A) U14.1(VOUT)
3V3: 3V3.1 C2.2 C3.2 C4.2 C23.2 C30.2 C31.2 C32.2 C33.2 C34.2 C35.2 C36.2 C37.2 C38.2 C61.1 C62.2 C64.2 C65.1 C70.2 C88.2 C89.2 C90.2 C91.2 DF1.1 DF1.3 DF1.5 FPC1.1 FPC1.2 FPC1.3 L2.2 L5.1 LED1.2(A) LED2.2(A) LED3.1(C) R3.2 R21.2 R22.2 R26.1 R27.2 R30.1 R44.1 SD1.4(VDD) U1.24(VDD_ETH) U1.29(AVDD3P3_USB) U1.42(AVDD_PLL) U1.65(AVDD_NODIE) U1.72(AVDD_PM_SPI) U1.84(AVDD_RTC) U1.89(VDDP_1) U1.116(AVDD_XTAL) U1.127(VDDP_0) U7.8(VCC) U8.8(VCC) U9.5(VDDIO) U9.8(VDD) U9.12(AP_CS) U14.3(EN) U14.4(VIN)
3V3_WLAN: U10.16(VDD) U10.17(RST)
3V3EN: C26.2 R8.2 R28.1 U3.1(EN)
5V: 5V0.1 C17.2 C19.2 C20.2 C21.2 C22.2 C79.1 C80.2 C81.2 C87.2 C92.2 C93.2 C94.2 CN5.1 L7.2 R8.1 R10.1 R11.1 R48.2 U3.4(IN) U4.4(VIN) U5.4(VIN) U13.6(VDD5) U13.7(VDD5) U15.1(C) U18.2
AVDD_AUD: C39.2 C40.1 L5.2 U1.32(AVDD_AUD)
GND: C2.1 C3.1 C4.1 C6.1 C7.1 C8.1 C9.1 C10.1 C11.1 C17.1 C19.1 C20.1 C21.1 C22.1 C23.1 C26.1 C27.1 C28.1 C30.1 C31.1 C32.1 C33.1 C34.1 C35.1 C36.1 C37.1 C38.1 C39.1 C40.2 C41.1 C42.1 C43.1 C44.1 C45.1 C46.1 C47.1 C48.1 C49.1 C50.1 C51.1 C52.1 C53.1 C54.1 C55.1 C56.1 C57.1 C58.1 C59.1 C61.2 C62.1 C63.2 C64.1 C65.2 C71.2 C72.2 C77.1 C80.1 C81.1 C82.2 C83.1 C84.1 C85.1 C86.1 C87.1 C88.1 C89.1 C90.1 C91.1 C92.1 C93.1 C94.1 CN2.4 CN2.5 CN2.6 CN3.5 CN3.6 CN5.4 CN5.5 CN5.6 CN6.2 CN6.5 CN6.6 CN6.7 CN6.8 DF1.6 DF1.21 DF1.22 DF1.27 DF1.28 DF1.29 DF1.30 DF1.31 F1.1 F1.2 F1.3 F1.4 FPC1.4 FPC1.7 FPC1.10 FPC1.13 FPC1.16 FPC1.19 FPC1.22 FPC1.25 FPC1.26 L6.1 R9.1 R12.1 R13.1 R15.2 R25.2 R29.1 R35.1 R36.1 R37.1 R45.1 R49.2 R53.2 SD1.6(VSS) SD1.10 SD1.11 SW1.2 SW1.3 SW1.4 U1.129(EP) U3.2(GND) U4.2(GND) U5.2(GND) U7.4(GND) U8.4(GND) U8.9(EP) U9.1(AP_SDO/AP_AD0) U9.6(GND) U9.7(FSYNC) U10.1(GND) U10.3(GND) U10.4(GND) U10.5(GND) U10.6(GND) U10.8(GND) U10.9(GND) U10.13(GND) U11.1(AGND) U11.11(PGND) U11.12(PGND) U11.13(PGND) U11.14(PGND) U11.15(PGND) U11.16(PGND) U13.1(GND) U13.4(GND) U13.8(GND) U13.9(GND) U13.10(GND) U13.11(GND) U13.12(GND) U13.13(GND) U13.14(GND) U13.15(GND) U13.16(GND) U13.17(GND) U13.18(GND) U14.2(GND) U14.5(SGND) U18.1 U18.3 U18.4 X1.2(GND) X1.4(GND)
VIN: C83.2 C84.2 CN6.1 R46.1 U11.8(IN) U11.19(IN) U11.21(IN) U11.22(IN) U11.23(IN)
AUD_VRM: C60.2 L6.2 U1.34(AUD_VRM_ADC)
ETH_LED0: U1.21(ETH_LED0)
ETH_LED1: U1.22(ETH_LED1)
ETH_RX+: F1.6 RN1.6 U1.26(ETH_RP)
ETH_RX-: F1.5 RN1.5 U1.25(ETH_RN)
ETH_TX+: F1.8 RN1.8 U1.28(ETH_TP)
ETH_TX-: F1.7 RN1.7 U1.27(ETH_TN)
FUART_RX: CN6.3 R38.1
FUART_TX: CN6.4 R39.1
GPIO0_LED1: R16.2 U1.56(PM_GPIO0)
GPIO1_LED2: TP6.1 U1.57(PM_GPIO1)
I2C0_SCL: R22.1 U1.19(I2C0_SCL) U9.13(AP_SCL/AP_SCLK)
I2C0_SDA: R21.1 U1.20(I2C0_SCA) U9.14(AP_SDA/AP_SDIO/AP_SDI)
I2C1_SCL: DF1.24 FPC1.23 R42.1 U1.113(SR0_IO18)
I2C1_SDA: DF1.26 FPC1.24 R43.1 U1.114(SR0_IO19)
MIPI_CK+: DF1.18 FPC1.11 U1.104(SR0_IO6)
MIPI_CK-: DF1.20 FPC1.12 U1.105(SR0_IO7)
MIPI_D0+: DF1.2 FPC1.5 U1.100(SR0_IO2)
MIPI_D0-: DF1.4 FPC1.6 U1.101(SR0_IO3)
MIPI_D1+: DF1.8 FPC1.8 U1.102(SR0_IO4)
MIPI_D1-: DF1.10 FPC1.9 U1.103(SR0_IO5)
MIPI_D2+: DF1.17 FPC1.14 U1.106(SR0_IO8)
MIPI_D2-: DF1.19 FPC1.15 U1.107(SR0_IO9)
MIPI_D3+: DF1.23 FPC1.17 U1.108(SR0_IO10)
MIPI_D3-: DF1.25 FPC1.18 U1.109(SR0_IO11)
MIPI_MCLK: DF1.9 FPC1.21 R41.2
MIPI_RST: DF1.7 FPC1.20 U1.111(SR0_IO16)
MP9447_FB: C79.2 R47.1 R48.1 R49.1 U11.3(FB)
MP9447_LC: C78.2 L7.1 R47.2 U11.9(SW) U11.10(SW) U11.17(SW) U11.18(SW) U11.24(SW) U11.25(SW)
PM_GPIO2: U1.58(PM_GPIO2)
PM_GPIO3: TP8.1 U1.59(PM_GPIO3)
PM_GPIO5: TP9.1 U1.61(PM_GPIO5)
PM_GPIO6: R29.2 U1.62(PM_GPIO6)
PM_GPIO7: TP10.1 U1.63(PM_GPIO7)
PM_I2CM_SCL: U1.54(PM_I2CM_SCL)
PM_I2CM_SDA: U1.55(PM_I2CM_SDA)
PM_RESET: C70.1 R35.2 U1.83(RESET)
PM_SPI_HOLD: U1.71(PM_SPI_HLD)
PM_SPI_SCK: R27.1 U1.67(PM_SPI_CK)
PM_SPI_SDI: U1.68(PM_SPI_DI)
PM_SPI_SDO: U1.69(PM_SPI_DO)
PM_SPI_WPZ: R25.1 U1.70(PM_SPI_WPZ)
SD_CDZ: LED3.2(A) R44.2 R53.1 SD1.9 U1.7(SD0_CDZ)
SD_CLK: SD1.5(CLK) U1.10(SD0_CLK)
SD_CMD: SD1.3(CMD) U1.11(SD0_CMD)
SD_DATA0: SD1.7(DAT0) U1.9(SD0_D0)
SD_DATA1: SD1.8(DAT1) U1.8(SD0_D1)
SD_DATA2: SD1.1(DAT2) U1.13(SD0_D2)
SD_DATA3: SD1.2(CD/DAT3) U1.12(SD0_D3)
SD_PWR_EN: U1.6(SD0_GPIO0)
SPI_CZ: U1.128(SPI_CZ) U7.1(CS#) U8.1(#CS)
SPI_HOLD: U1.5(SPI_HLD) U7.7(IO3) U8.7(#HOLD-OR-#REST/IO3)
SPI_SCK: U1.1(SPI_CK) U7.6(CLK) U8.6(CLK)
SPI_SDI: U1.2(SPI_DI) U7.5(DI) U8.5(DI/IO0)
SPI_SDO: U1.3(SPI_DO) U7.2(DO) U8.2(DO/IO1)
SPI_WPZ: U1.4(SPI_WPZ) U7.3(IO2) U8.3(#WP/IO2)
SW_RST: C63.1 R26.2 U1.60(PM_GPIO4)
UART_RX0: CN2.1 R19.1
UART_RX1: R24.1
UART_TX0: CN2.2 R20.1
UART_TX1: R23.1
USB_DM: CN5.2 U1.30(USB2_DM) U10.15(DM) U13.3(DN)
USB_DP: CN5.3 U1.31(USB2_DP) U10.14(DP) U13.2(DP)
XTAL_IN: C72.1 R40.1 U1.117(XTAL_IN) X1.1(OSC1)
XTAL_OUT: C71.1 R40.2 U1.118(XTAL_OUT) X1.3(OSC2)
$2N79255: C60.1 U1.33(AUD_AVG)
$2N79483: R41.1 U1.112(SR0_IO17)
$2N80001: C58.2 U1.43(DVDD_DDR_RX)
$2N80007: C59.2 U1.73(DVDD_NODIE)
$2N80073: R19.2 U1.50(PM_UART_RX)
$2N80075: R20.2 U1.51(PM_UART_TX)
$2N80136: R24.2 U1.52(PM_UART_RX1)
$2N80138: R23.2 U1.53(PM_UART_TX1)
$2N80309: R30.2 U1.64(PM_GPIO8)
$2N80502: R28.2 SW1.1
$2N80698: R36.2 U1.85(XTAL_IN_32K)
$2N80700: R37.2 U1.86(XTAL_OUT_32K)
$2N80702: R38.2 U1.90(FUART_RX)
$2N80704: R39.2 U1.91(FUART_TX)
$2N81554: CN3.4 RN1.1
$2N81555: CN3.3 RN1.2
$2N81556: CN3.2 RN1.3
$2N81557: CN3.1 RN1.4
$2N98270: CN2.3 U15.2(A)
$3N1560: C28.2 R11.2 U4.1(EN)
$3N1561: L3.1 U4.3(LX)
$3N1564: C5.1 R4.1 R12.2 U4.5(FB)
$3N1574: R5.1 R13.2 U5.5(FB)
$3N1576: L2.1 U3.3(LX)
$3N1578: R3.1 R9.2 U3.5(FB)
$3N1588: C27.2 R10.2 U5.1(EN)
$3N1592: L4.1 U5.3(LX)
$3N3000: LED2.1(C) R16.1
$3N3008: LED1.1(C) R15.1
$3N13162: C82.1 U11.20(VCC)
$3N13175: R45.2 U11.2(FREQ)
$3N13176: R46.2 U11.5(EN)
$3N13177: C78.1 U11.7(BST)
$3N13178: C77.2 U11.4(SS)

Not connected (* = marked no-connect by the designer): DF1 11* 12* 13* 14* 15* 16*; U1 14(I2S0_MCLK)* 15(I2S0_BCK)* 16(I2S0_WCK)* 17(I2S0_DI)* 18(I2S0_DO)* 35(AUD_MICIN0)* 36(AUD_MICCM0)* 37(AUD_MICIN1)* 38(AUD_MICCM1)* 39(AUD_LINEOUT_L0)* 66(PM_SPI_CZ)* 74(SAR_GPIO0)* 75(SAR_GPIO1)* 76(SAR_GPIO2)* 77(SAR_GPIO3)* 78(NC)* 79(NC)* 80(NC)* 81(NC)* 82(NC)* 92(FUART_CTS)* 93(FUART_RTS)* 94(GPIO0)* 95(GPIO1)* 98(SR0_IO0)* 99(SR0_IO1)* 110(SR0_IO14)* 119(SE_XTAL_OUT)* 121(GPIO8)* 122(GPIO9)* 123(GPIO12)* 124(GPIO13)* 125(GPIO14)* 126(GPIO15)*; U9 2(RESV)* 3(RESV)* 4(INT1/INT)* 9(INT2)* 10(RESV)* 11(RESV)*; U10 2(RF1) 7(RF0) 10(NC) 11(NC) 12(NC); U11 6(NC)*; U13 5(#RST)*

## Notes on the sheets
sheet 1
- 0603磁珠120Ω100Mhz
- debug-LAN4p
- 不行就改2.2-10r
- 3V3延迟通电
- WLAN-USB
- DBG-UART
- PM_SPI_WPZ 需一直拉低
  PM_SPI_SDO 拉低NAND，拉高NOR FLASH，内部已拉高
  PM_SPI_SCK 拉高跳过SD卡检测，快速启动
- NOR/NAND SPI FLASH
- LOW ACTIVE
- SD CARD
- FOR DVFS
- 接飞控串口mavlink或MSPOSD数据，
  加电源输入
- LAN_LINK
  LAN_ACT
- ETH NETWROK
- High Active
- 注意核对封装13与14、 26引脚位置同侧。
  DJI副厂同轴线中间6脚11-16不通！！！固不使用
- SR_VS
  SR_HS
- 使用国内社区群友约定线序，
  兼容立创开源的openipc摄像头(DF56座子与主板的反序)
- MIPI CAMERA
sheet 2
- 5v->3.3v
- 二级降压
- 3015 2A
- 1%
- C0603
- C0603
- C0402
- C0603
- C0402
- 1%
- Power on sequence , 1.0V no later than 3.3V_SYS.
  充电延时=R*C*ln[(V-Ven)/V]
- 5v->1.0v
- Imax>=0.5A
  1.0V±3%
- 3015 2A
- 1%
- C0603
- C0603
- C0402
- C0603
- C0402
- 1%
- Vout=0.6*(1+R1/R2)=0.6*(1+51/75)=1.0V
- 5v->1.5v
- Imax>=0.3A
  1.5V±3%
- SWPA3015 2A
- 1%
- C0603
- C0603
- C0402
- C0603
- C0402
- 1%
